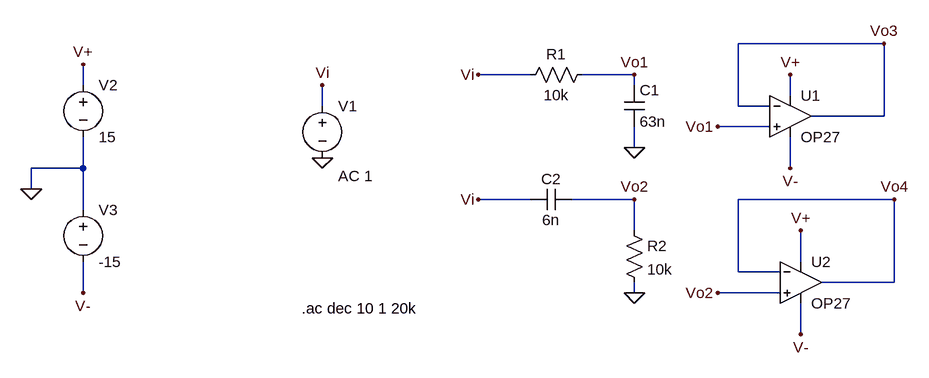
[diagram p0: schematic Projeto integrador.asc]
Projeto integrador.asc, the LTspice schematic file:
Version 4
SHEET 1 880 680
WIRE 752 0 528 0
WIRE 208 48 128 48
WIRE 368 48 288 48
WIRE -480 64 -480 32
WIRE 368 64 368 48
WIRE 608 80 608 48
WIRE -112 96 -112 64
WIRE 528 96 528 0
WIRE 576 96 528 96
WIRE 752 112 752 0
WIRE 752 112 640 112
WIRE 576 128 496 128
WIRE 368 160 368 128
WIRE -480 192 -480 144
WIRE -480 192 -560 192
WIRE 608 192 608 144
WIRE -560 224 -560 192
WIRE 208 240 128 240
WIRE 368 240 272 240
WIRE 768 240 528 240
WIRE -480 256 -480 192
WIRE 368 288 368 240
WIRE 624 336 624 288
WIRE 528 352 528 240
WIRE 592 352 528 352
WIRE 768 368 768 240
WIRE 768 368 656 368
WIRE -480 384 -480 336
WIRE 368 384 368 368
WIRE 592 384 496 384
WIRE 624 448 624 400
FLAG -112 64 Vi
FLAG -112 176 0
FLAG 128 48 Vi
FLAG 128 240 Vi
FLAG 368 48 Vo1
FLAG 368 384 0
FLAG 368 160 0
FLAG 368 240 Vo2
FLAG -560 224 0
FLAG -480 32 V+
FLAG -480 384 V-
FLAG 608 48 V+
FLAG 608 192 V-
FLAG 624 288 V+
FLAG 624 448 V-
FLAG 496 128 Vo1
FLAG 496 384 Vo2
FLAG 752 0 Vo3
FLAG 768 240 Vo4
SYMBOL voltage -112 80 R0
WINDOW 123 24 124 Left 2
WINDOW 39 0 0 Left 0
SYMATTR Value2 AC 1
SYMATTR InstName V1
SYMATTR Value ""
SYMBOL res 304 32 R90
WINDOW 0 0 56 VBottom 2
WINDOW 3 32 56 VTop 2
SYMATTR InstName R1
SYMATTR Value 10k
SYMBOL cap 272 224 R90
WINDOW 0 0 32 VBottom 2
WINDOW 3 32 32 VTop 2
SYMATTR InstName C2
SYMATTR Value 6n
SYMBOL cap 352 64 R0
SYMATTR InstName C1
SYMATTR Value 63n
SYMBOL res 352 272 R0
SYMATTR InstName R2
SYMATTR Value 10k
SYMBOL voltage -480 48 R0
SYMATTR InstName V2
SYMATTR Value 15
SYMBOL voltage -480 240 R0
SYMATTR InstName V3
SYMATTR Value -15
SYMBOL Opamps\\OP27 608 48 R0
SYMATTR InstName U1
SYMBOL Opamps\\OP27 624 304 R0
SYMATTR InstName U2
TEXT -144 408 Left 2 !.ac dec 10 1 20k

The netlist it stands for:
* Projeto integrador.asc
V1 Vi 0 AC 1
R1 Vo1 Vi 10k
C2 Vo2 Vi 6n
C1 Vo1 0 63n
R2 Vo2 0 10k
V2 V+ 0 15
V3 0 V- -15
XU1 Vo1 Vo3 V+ V- Vo3 OP27  ; pins In+ In- V+ V- OUT
XU2 Vo2 Vo4 V+ V- Vo4 OP27  ; pins In+ In- V+ V- OUT
.ac dec 10 1 20k
.lib ADI.lib
.backanno
.end

* Results of the author's LTspice run, read from the files saved beside the schematic
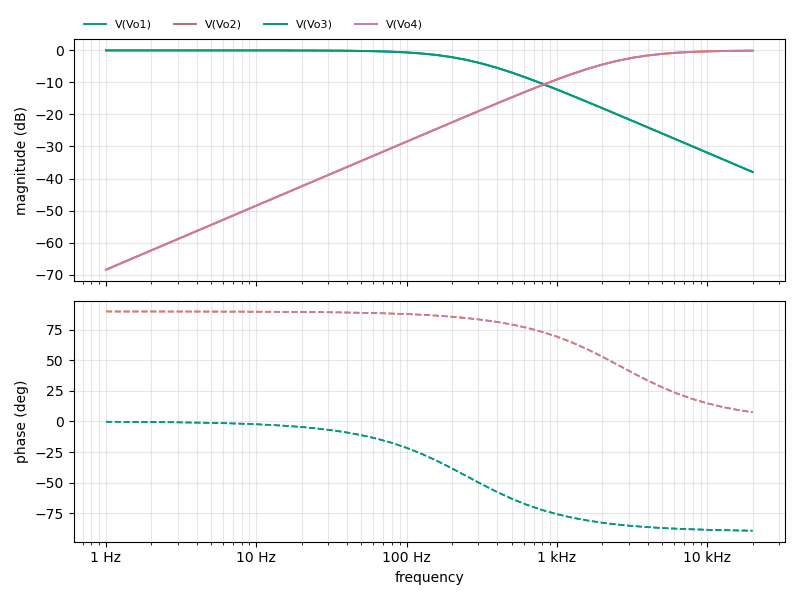
[diagram p1: AC Analysis of Projeto integrador.asc, plotted from the saved traces]
* AC Analysis, 1 run:
*   V(Vo1): -0.00 dB at 1 Hz, -37.97 dB at 20 kHz, peak -0.00 dB at 1 Hz, 3 dB below the peak at 252.5 Hz
*   V(Vo2): -68.47 dB at 1 Hz, -0.08 dB at 20 kHz, peak -0.08 dB at 20 kHz, 3 dB below the peak at 2.617 kHz
*   V(Vo3): -0.00 dB at 1 Hz, -37.97 dB at 20 kHz, peak -0.00 dB at 1 Hz, 3 dB below the peak at 252.5 Hz
*   V(Vo4): -68.47 dB at 1 Hz, -0.08 dB at 20 kHz, peak -0.08 dB at 20 kHz, 3 dB below the peak at 2.617 kHz